# EAGLE design Tiny84EncoderReader (EAGLE 7.5.0)
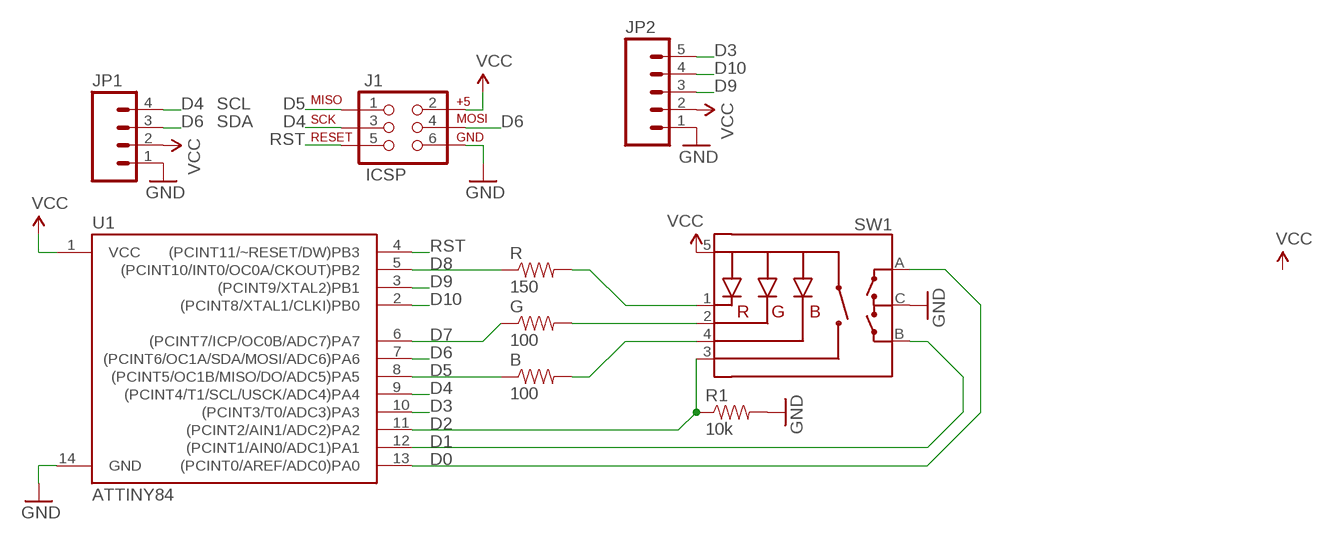
[diagram p0: schematic, sheet 1]

## Parts
B  100  RESISTOR0805-RES  [0805]
G  100  RESISTOR0805-RES  [0805]
J1  ICSP  AVR_SPI_PRG_6LABELED  [2X3-NS]
JP1  M04PTH  [1X04]
JP2  M05PTH  [1X05]
R  150  RESISTOR0805-RES  [0805]
R1  10k  RESISTOR0805-RES  [0805]
SW1  ENCODER_RGB_CA  [ENCODER_LED_3]
U1  ATTINY84  [SO14]

## Nets
B: B.2 SW1.4(-B)
D0: SW1.A U1.13((PCINT0/AREF/ADC0)PA0)
D1: SW1.B U1.12((PCINT1/AIN0/ADC1)PA1)
D2: R1.1 SW1.3(SW) U1.11((PCINT2/AIN1/ADC2)PA2)
D3: JP2.5 U1.10((PCINT3/T0/ADC3)PA3)
D4: J1.3(SCK) JP1.4 U1.9((PCINT4/T1/SCL/USCK/ADC4)PA4)
D5: B.1 J1.1(MISO) U1.8((PCINT5/OC1B/MISO/DO/ADC5)PA5)
D6: J1.4(MOSI) JP1.3 U1.7((PCINT6/OC1A/SDA/MOSI/ADC6)PA6)
D7: G.1 U1.6((PCINT7/ICP/OC0B/ADC7)PA7)
D8: R.1 U1.5((PCINT10/INT0/OC0A/CKOUT)PB2)
D9: JP2.3 U1.3((PCINT9/XTAL2)PB1)
D10: JP2.4 U1.2((PCINT8/XTAL1/CLKI)PB0)
G: G.2 SW1.2(-G)
GND: J1.6(GND) JP1.1 JP2.1 R1.2 SW1.C U1.14(GND)
R: R.2 SW1.1(-R)
RST: J1.5(RST) U1.4((PCINT11/~RESET/DW)PB3)
VCC: J1.2(V+) JP1.2 JP2.2 SW1.5(+) U1.1(VCC)

## Notes on the sheet
- SCL
- SDA

## Library data of the parts
B G R R1 = barbary_enterprises:RESISTOR: Resistor Basic schematic elements and footprints for 0603, 1206, and PTH resistors.
J1 = barbary_enterprises:AVR_SPI_PRG_6: AVR ISP 6 Pin This is the reduced ISP connector for AVR programming. Common on Arduino. This footprint will take up less PCB space and can be used with a 10-pin to 6-pin adapter such as SKU: BOB-08508
JP1 = SparkFun-Connectors:M04: Header 4 Standard 4-pin 0.1" header. Use with straight break away headers (SKU : PRT-00116), right angle break away headers (PRT-00553), swiss pins (PRT-00743), machine pins (PRT-00117), and female headers (PRT-00115). Molex polarized connector foot print use with SKU : PRT-08231 with associated crimp pins and housings. 1MM SMD Version SKU: PRT-10208
JP2 = SparkFun-Connectors:M05: Header 5 Standard 5-pin 0.1" header. Use with straight break away headers (SKU : PRT-00116), right angle break away headers (PRT-00553), swiss pins (PRT-00743), machine pins (PRT-00117), and female headers (PRT-00115). Molex polarized connector foot print use with SKU : PRT-08230 with associated crimp pins and housings.
SW1 = SparkFun-Electromechanical:ENCODER_RGB_CA: Illuminated Rotary Encoder w/ RGB LED and select switch EC12PLRGBSDVBF-D: http://top-up.so-buy.com/front/bin/ptdetail.phtml?Part=EC12PLRGBSDVBF-D
U1 = SparkFun-DigitalIC:ATTINY84: Atmel 14-pin 2/4/8kB flash uC; PROD_ID: IC-11285

## Board
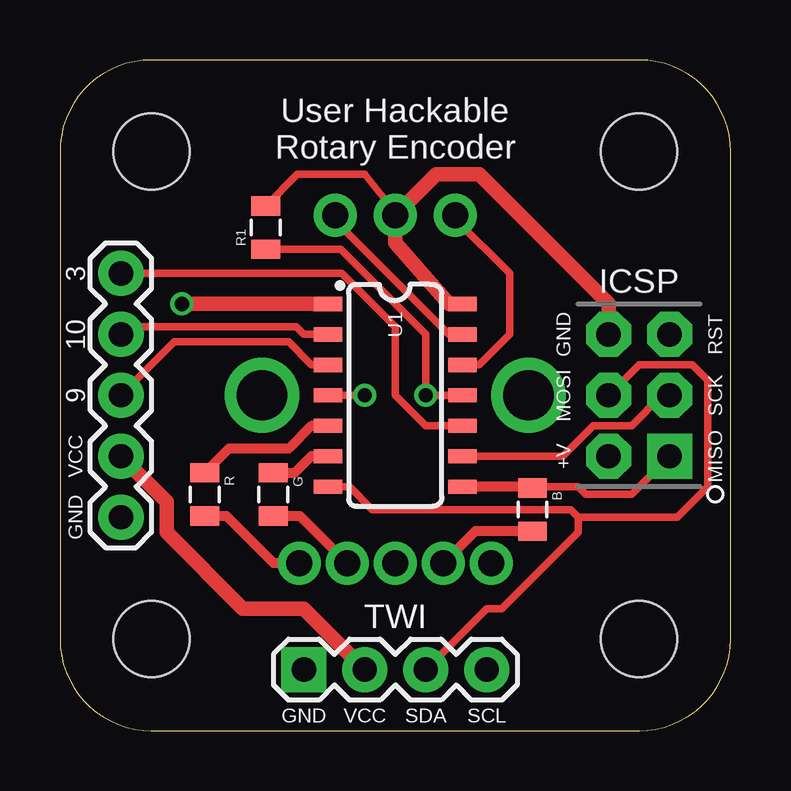
[diagram p1: board, top side]
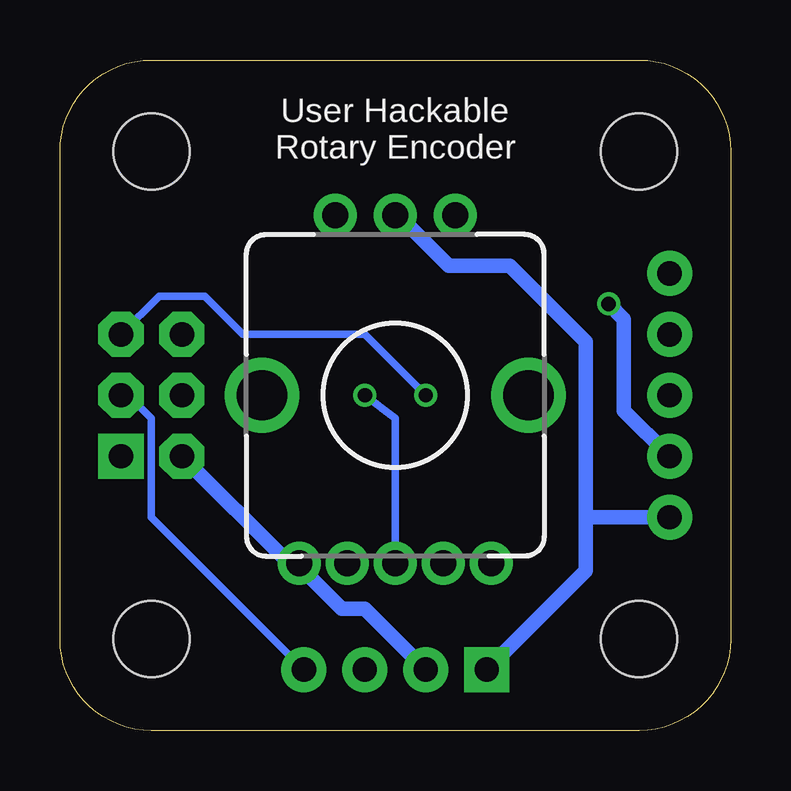
[diagram p2: board, bottom side, seen from below]

Size 27.94 x 27.94 mm. Coordinates in mm from the lower left corner, seen from the top.
Outline: 0,24.13 0,3.81 arc90 3.81,0 24.13,0 arc90 27.94,3.81 27.94,24.13 arc90 24.13,27.94 3.81,27.94 arc90 0,24.13
Copper layers (1*16): Top 0.0356mm / dielectric 1.5011mm / Bottom 0.0356mm
Design rules "LaenPCBOrder": minimum track width 6mil, minimum drill 13mil, track to track 6mil, track to pad 6mil, pad to pad 6mil, via to via 6mil, smd to smd 6mil, copper to edge 15mil, drill to drill 6mil, minimum pad ring 7mil, minimum via ring 7mil, stop-mask expansion 3mil, vias tented up to drill 0mil, thermal gap 10mil
Holes 3.17 mm at 3.81,3.81 24.13,3.81 24.13,24.13 3.81,24.13

### Footprints (pad centres in the part's own frame; a part is rotated, then mirrored left to right if it is on the bottom)
0805 = smd 0.8 x 1.2: 1 -0.9,0; 2 0.9,0
2X3-NS = drill 1.016 pad 1.88 square: 1 -2.54,-1.27 | drill 1.016 pad 1.88 octagon: 2 -2.54,1.27; 3 0,-1.27; 4 0,1.27; 5 2.54,-1.27; 6 2.54,1.27
1X04 = drill 1.016 pad 1.88 square: 1 0,0 | drill 1.016 pad 1.88: 2 2.54,0; 3 5.08,0; 4 7.62,0
1X05 = drill 1.016 pad 1.88: 1 0,0; 2 2.54,0; 3 5.08,0; 4 7.62,0; 5 10.16,0
ENCODER_LED_3 = drill 1.1 pad 1.778: 1 -4,7; 2 -2,7; 3 0,7; 4 2,7; 5 4,7 | drill 1.1 pad 1.8: A -2.5,-7.5; B 2.5,-7.5; C 0,-7.5 | drill 2.1: M1 -5.55,0; M2 5.55,0
SO14 = smd 0.6 x 1.2: 1 -3.81,-2.8; 2 -2.54,-2.8; 3 -1.27,-2.8; 4 0,-2.8; 5 1.27,-2.8; 6 2.54,-2.8; 7 3.81,-2.8; 8 3.81,2.8; 9 2.54,2.8; 10 1.27,2.8; 11 0,2.8; 12 -1.27,2.8; 13 -2.54,2.8; 14 -3.81,2.8

### Placement (x,y rotation side)
B  19.68,9.21 270 top
G  8.89,9.84 270 top
J1  24.13,13.97 90 top
JP1  10.16,2.54 0 top
JP2  2.54,8.89 90 top
R  6.03,9.84 270 top
R1  8.57,20.95 90 top
SW1  13.97,13.97 180 bottom
U1  13.97,13.97 270 top

### Tracks (layer width: path | path; a pad name or v marks a point on that pad's centre or on a via)
B
  Top 0.406: B.2 17.31,8.31 SW1.4
D0
  Top 0.305: U1.13 16.19,16.51 11.47,21.23 SW1.A
D1
  Top 0.305: SW1.B 16.47,21.31 18.73,19.05 18.73,16.51 17.46,15.24 U1.12
D2  (via drill 0.6)
  Top 0.305: U1.11 v15.24,13.97 15.24,16.51 11.7,20.05 R1.1
  Bottom 0.305: SW1.3 13.97,13.02 v15.24,13.97
D3
  Top 0.305: U1.10 15.24,12.7 13.97,13.97 13.97,16.83 11.75,19.05 JP2.5
D4
  Top 0.305: J1.3 25.08,13.97 23.81,12.7 22.23,12.7 20.95,11.43 U1.9
  Bottom 0.305: JP1.4 24.13,8.89 24.13,13.02 25.08,13.97 J1.3
D5
  Top 0.305: J1.1 23.81,9.84 21.91,9.84 21.59,10.16 19.74,10.16
  Top 0.406: 19.74,10.16 B.1 19.63,10.16 U1.8
D6
  Top 0.305: J1.4 24.13,15.24 26.35,15.24 26.99,14.61 26.99,10.16 25.72,8.89 21.59,8.89 | 21.59,8.89 21.59,8.26 18.41,5.08 17.78,5.08 JP1.3 | U1.7 12.06,10.16 13.02,9.21 21.27,9.21 21.59,8.89
D7
  Top 0.406: G.1 9.79,10.74 10.48,11.43 U1.6
D8
  Top 0.406: U1.5 10.48,12.7 9.53,11.75 7.04,11.75 R.1
D9
  Top 0.305: U1.3 10.48,15.24 9.53,16.19 4.76,16.19 JP2.3
D10
  Top 0.305: U1.2 10.16,16.51 9.84,16.83 2.86,16.83 JP2.4
G
  Top 0.406: G.2 10,8.94 SW1.2
GND
  Top 0.305: R1.2 9.89,23.18 12.7,23.18 13.97,21.59
  Top 0.406: 13.97,21.59 SW1.C
  Top 0.61: U1.14 16.19,17.78 13.97,20.32 SW1.C 15.68,23.18 17.46,23.18 22.86,17.78 J1.6
  Bottom 0.305: 13.97,21.59 SW1.C
  Bottom 0.61: JP1.1 6.03,6.67 6.03,8.89 | 6.03,8.89 6.03,16.19 9.21,19.37 11.75,19.37 13.97,21.59 | JP2.1 6.03,8.89
R
  Top 0.406: R.2 6.93,8.94 8.89,6.99 9.96,6.99 SW1.1
RST  (via drill 0.6)
  Top 0.305: U1.4 v12.7,13.97
  Bottom 0.305: v12.7,13.97 15.24,16.51 20.32,16.51 21.91,18.1 23.81,18.1 J1.5
VCC  (via drill 0.6)
  Top 0.61: JP2.2 4.45,9.53 4.45,8.26 7.62,5.08 10.16,5.08 JP1.2 | U1.1 v5.08,17.78
  Bottom 0.406: 17.98,6.87 17.98,6.99
  Bottom 0.61: JP1.2 15.24,5.08 16.19,5.08 17.98,6.87 | SW1.5 17.98,6.99 18.41,6.99 J1.2 | v5.08,17.78 4.45,17.14 4.45,13.34 JP2.2

### Text on the board
tPlace: User Hackable / Rotary Encoder | 3 | ICSP | 10 | 9 | VCC | GND | TWI | GND | VCC | SDA | SCL
bPlace: User Hackable / Rotary Encoder